# EAGLE design AeroQuadWii_v100 (EAGLE 5.10)
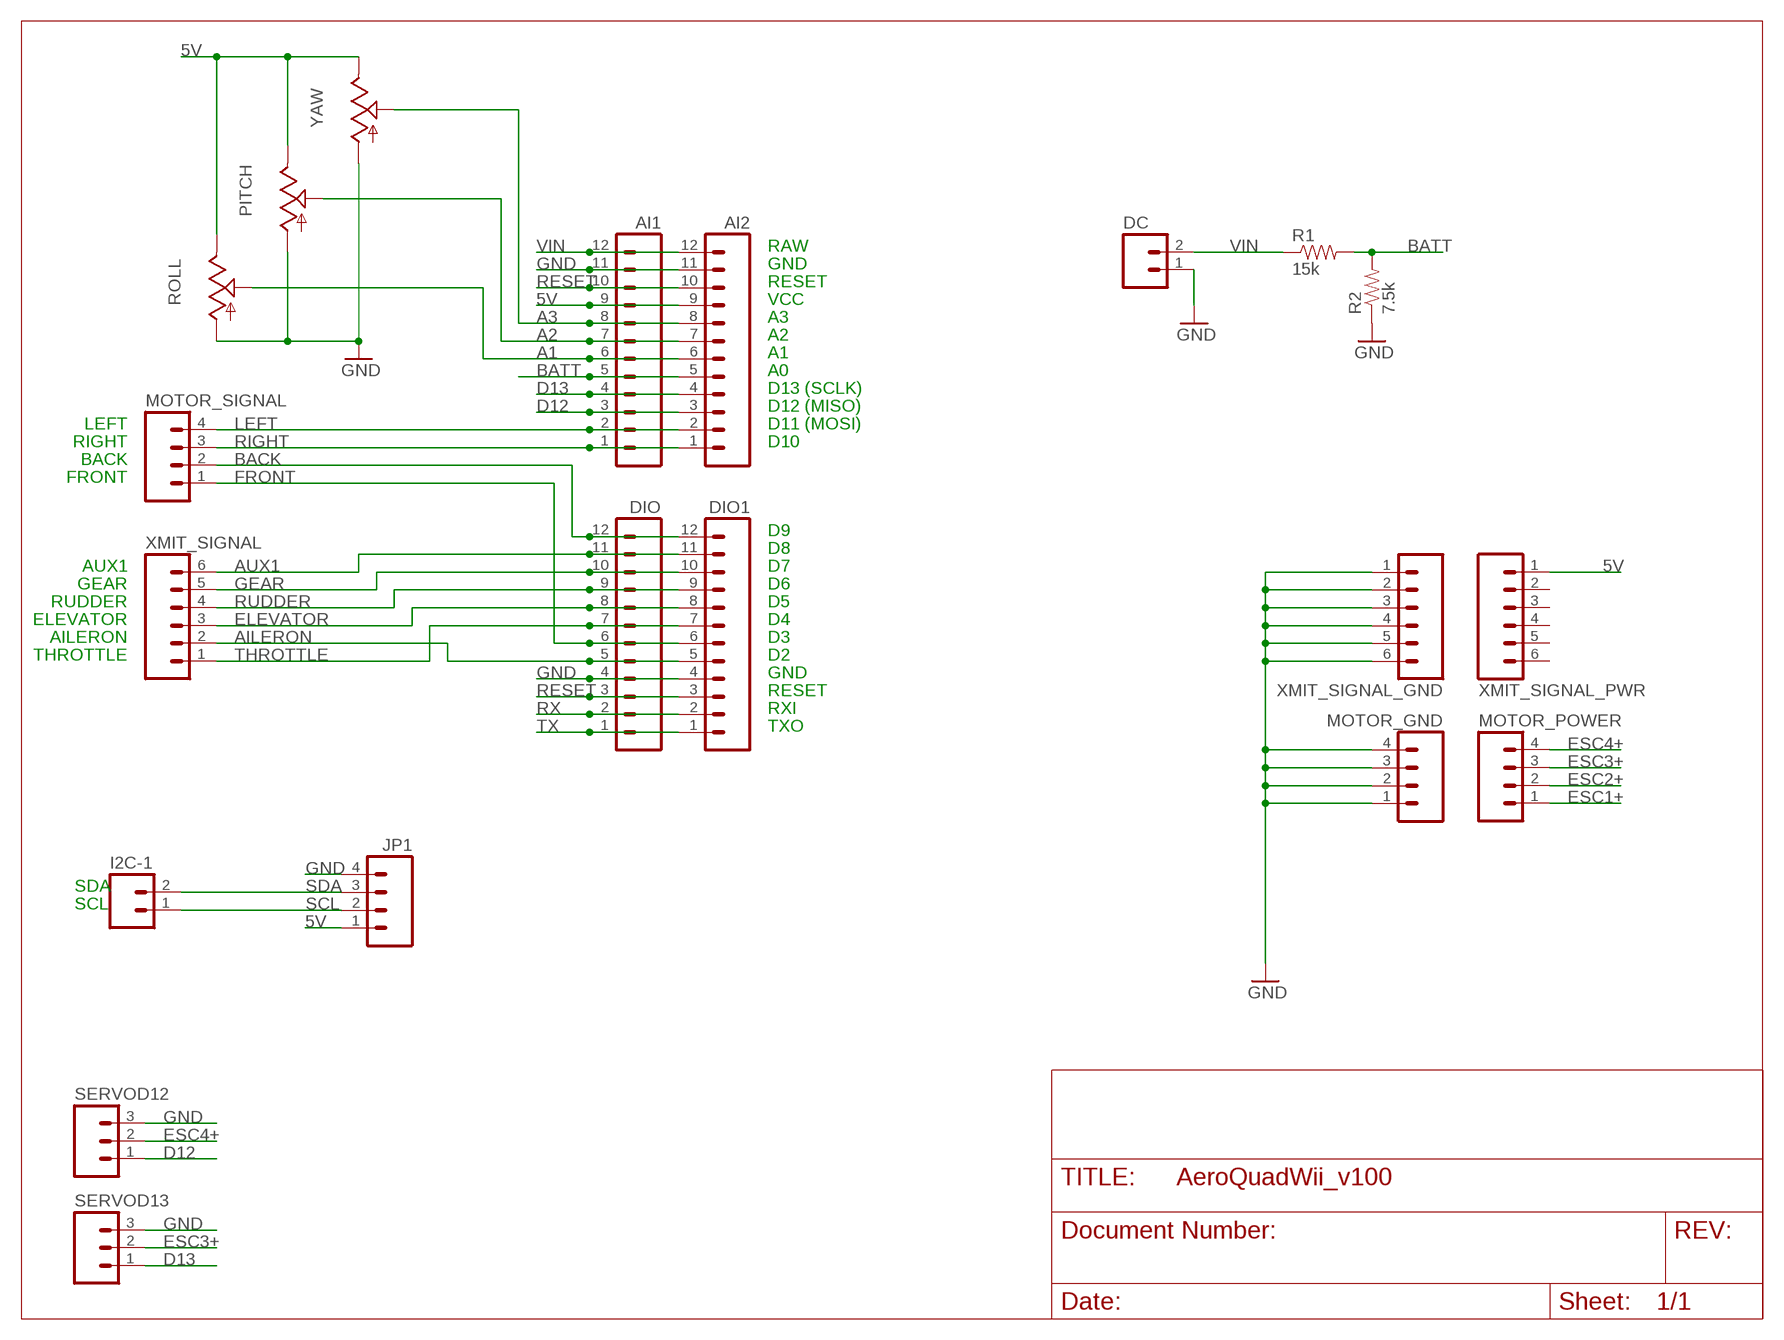
[diagram p0: schematic, sheet 1]

## Parts
AI1  M12LOCK  [1X12_LOCK]
AI2  M12LOCK  [1X12_LOCK]
DC  M02LOCK  [1X02_LOCK]
DIO  M12LOCK  [1X12_LOCK]
DIO1  M12LOCK  [1X12_LOCK]
I2C-1  M02LOCK  [1X02_LOCK]
JP1  M04LOCK  [1X04_LOCK]
MOTOR_GND  M04LOCK  [1X04_LOCK]
MOTOR_POWER  M04LOCK  [1X04_LOCK]
MOTOR_SIGNAL  M04LOCK  [1X04_LOCK]
PITCH  TRIM_US-CA6H  [CA6H]
R1  15k  RESISTORPTH-1/6W  [1/6W-RES]
R2  7.5k  RESISTORPTH-1/6W  [1/6W-RES]
ROLL  TRIM_US-CA6H  [CA6H]
SERVOD12  M03LOCK  [1X03_LOCK]
SERVOD13  M03LOCK  [1X03_LOCK]
XMIT_SIGNAL  M06LOCK  [1X06_LOCK]
XMIT_SIGNAL_GND  M06LOCK  [1X06_LOCK]
XMIT_SIGNAL_PWR  M06LOCK  [1X06_LOCK]
YAW  TRIM_US-CA6H  [CA6H]

## Nets
5V: AI1.9 AI2.9 JP1.1 PITCH.E ROLL.E XMIT_SIGNAL_PWR.1 YAW.E
A1: AI1.6 AI2.6 ROLL.S
A2: AI1.7 AI2.7 PITCH.S
A3: AI1.8 AI2.8 YAW.S
AILERON: DIO1.5 DIO.5 XMIT_SIGNAL.2
AUX1: DIO1.11 DIO.11 XMIT_SIGNAL.6
BACK: DIO1.12 DIO.12 MOTOR_SIGNAL.2
BATT: AI1.5 AI2.5 R1.2 R2.2
D12: AI1.3 AI2.3 SERVOD12.1
D13: AI1.4 AI2.4 SERVOD13.1
ELEVATOR: DIO1.8 DIO.8 XMIT_SIGNAL.3
ESC1+: MOTOR_POWER.1
ESC2+: MOTOR_POWER.2
ESC3+: MOTOR_POWER.3 SERVOD13.2
ESC4+: MOTOR_POWER.4 SERVOD12.2
FRONT: DIO1.6 DIO.6 MOTOR_SIGNAL.1
GEAR: DIO1.10 DIO.10 XMIT_SIGNAL.5
GND: AI1.11 AI2.11 DC.1 DIO1.4 DIO.4 JP1.4 MOTOR_GND.1 MOTOR_GND.2 MOTOR_GND.3 MOTOR_GND.4 PITCH.A R2.1 ROLL.A SERVOD12.3 SERVOD13.3 XMIT_SIGNAL_GND.1 XMIT_SIGNAL_GND.2 XMIT_SIGNAL_GND.3 XMIT_SIGNAL_GND.4 XMIT_SIGNAL_GND.5 XMIT_SIGNAL_GND.6 YAW.A
LEFT: AI1.2 AI2.2 MOTOR_SIGNAL.4
RESET: AI1.10 AI2.10 DIO1.3 DIO.3
RIGHT: AI1.1 AI2.1 MOTOR_SIGNAL.3
RUDDER: DIO1.9 DIO.9 XMIT_SIGNAL.4
RX: DIO1.2 DIO.2
SCL: I2C-1.1 JP1.2
SDA: I2C-1.2 JP1.3
THROTTLE: DIO1.7 DIO.7 XMIT_SIGNAL.1
TX: DIO1.1 DIO.1
VIN: AI1.12 AI2.12 DC.2 R1.1
Unconnected: XMIT_SIGNAL_PWR.2 XMIT_SIGNAL_PWR.3 XMIT_SIGNAL_PWR.4 XMIT_SIGNAL_PWR.5 XMIT_SIGNAL_PWR.6

## Notes on the sheet
- RAW
- GND
- RESET
- VCC
- A3
- A2
- A1
- A0
- D13 (SCLK)
- D12 (MISO)
- LEFT | D11 (MOSI)
- RIGHT | D10
- BACK
- FRONT
- D9
- D8
- AUX1 | D7
- GEAR | D6
- RUDDER | D5
- ELEVATOR | D4
- AILERON | D3
- THROTTLE | D2
- GND
- RESET
- RXI
- TXO
- SDA
- SCL

## Library data of the parts
AI1 AI2 DIO DIO1 = SparkFun:M12: Header 12 Standard 12-pin 0.1" header. Use with straight break away headers (SKU : PRT-00116), right angle break away headers (PRT-00553), swiss pins (PRT-00743), machine pins (PRT-00117), and female headers (PRT-00115).
DC I2C-1 = SparkFun:M02: Header 2 Standard 2-pin 0.1" header. Use with straight break away headers (SKU : PRT-00116), right angle break away headers (PRT-00553), swiss pins (PRT-00743), machine pins (PRT-00117), and female headers (PRT-00115). Molex polarized connector foot print use with SKU : PRT-08233 with associated crimp pins and housings.
JP1 MOTOR_GND MOTOR_POWER MOTOR_SIGNAL = SparkFun:M04: Header 4 Standard 4-pin 0.1" header. Use with straight break away headers (SKU : PRT-00116), right angle break away headers (PRT-00553), swiss pins (PRT-00743), machine pins (PRT-00117), and female headers (PRT-00115). Molex polarized connector foot print use with SKU : PRT-08231 with associated crimp pins and housings.
PITCH ROLL YAW = pot:TRIM_US-: POTENTIOMETER
R1 R2 = SparkFun:RESISTOR: Resistor Basic schematic elements and footprints for 0603, 1206, and PTH 1/10th watt (small) resistors.
SERVOD12 SERVOD13 = SparkFun:M03: Header 3 Standard 3-pin 0.1" header. Use with straight break away headers (SKU : PRT-00116), right angle break away headers (PRT-00553), swiss pins (PRT-00743), machine pins (PRT-00117), and female headers (PRT-00115). Molex polarized connector foot print use with SKU : PRT-08232 with associated crimp pins and housings.
XMIT_SIGNAL XMIT_SIGNAL_GND XMIT_SIGNAL_PWR = SparkFun:M06: Header 6 Standard 6-pin 0.1" header. Use with straight break away headers (SKU : PRT-00116), right angle break away headers (PRT-00553), swiss pins (PRT-00743), machine pins (PRT-00117), and female headers (PRT-00115). Molex polarized connector foot print use with SKU : PRT-08094 with associated crimp pins and housings. NOTES ON THE VARIANTS LOCK and LOCK_LONGPADS... This footprint was designed to help hold the alignment of a through-hole component (i.e. 6-pin header) while soldering it into place. You may notice that each hole has been shifted either up or down by 0.005 of an inch from it's more standard position (which is a perfectly straight line). This slight alteration caused the pins (the squares in the middle) to touch the edges of the holes. Because they are alternating, it causes a "brace" to hold the component in place. 0.005 has proven to be the perfect amount of "off-center" position when using our standard breakaway headers. Although looks a little odd when you look at the bare footprint, once you have a header in there, the alteration is very hard to notice. Also, if you push a header all the way into place, it is covered up entirely on the bottom side. This idea of altering the position of holes to aid alignment will be further integrated into the Sparkfun Library for other footprints. It can help hold any component with 3 or more connection pins.

## Board
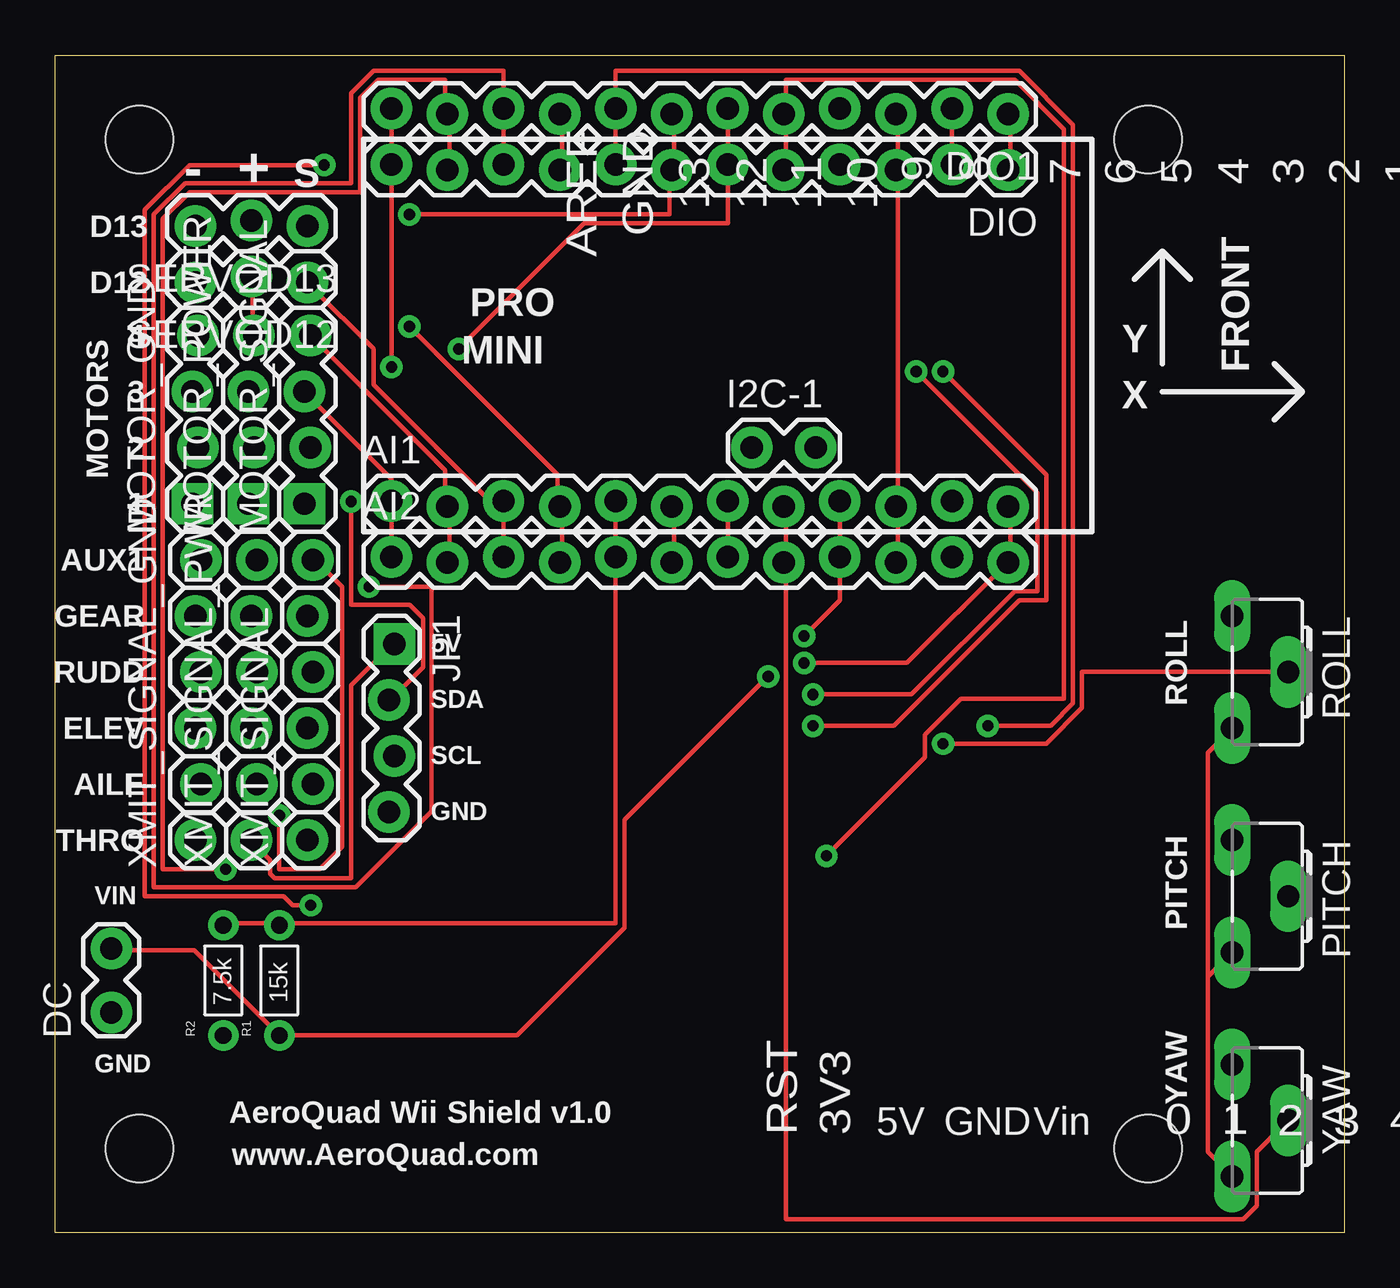
[diagram p1: board, top side]
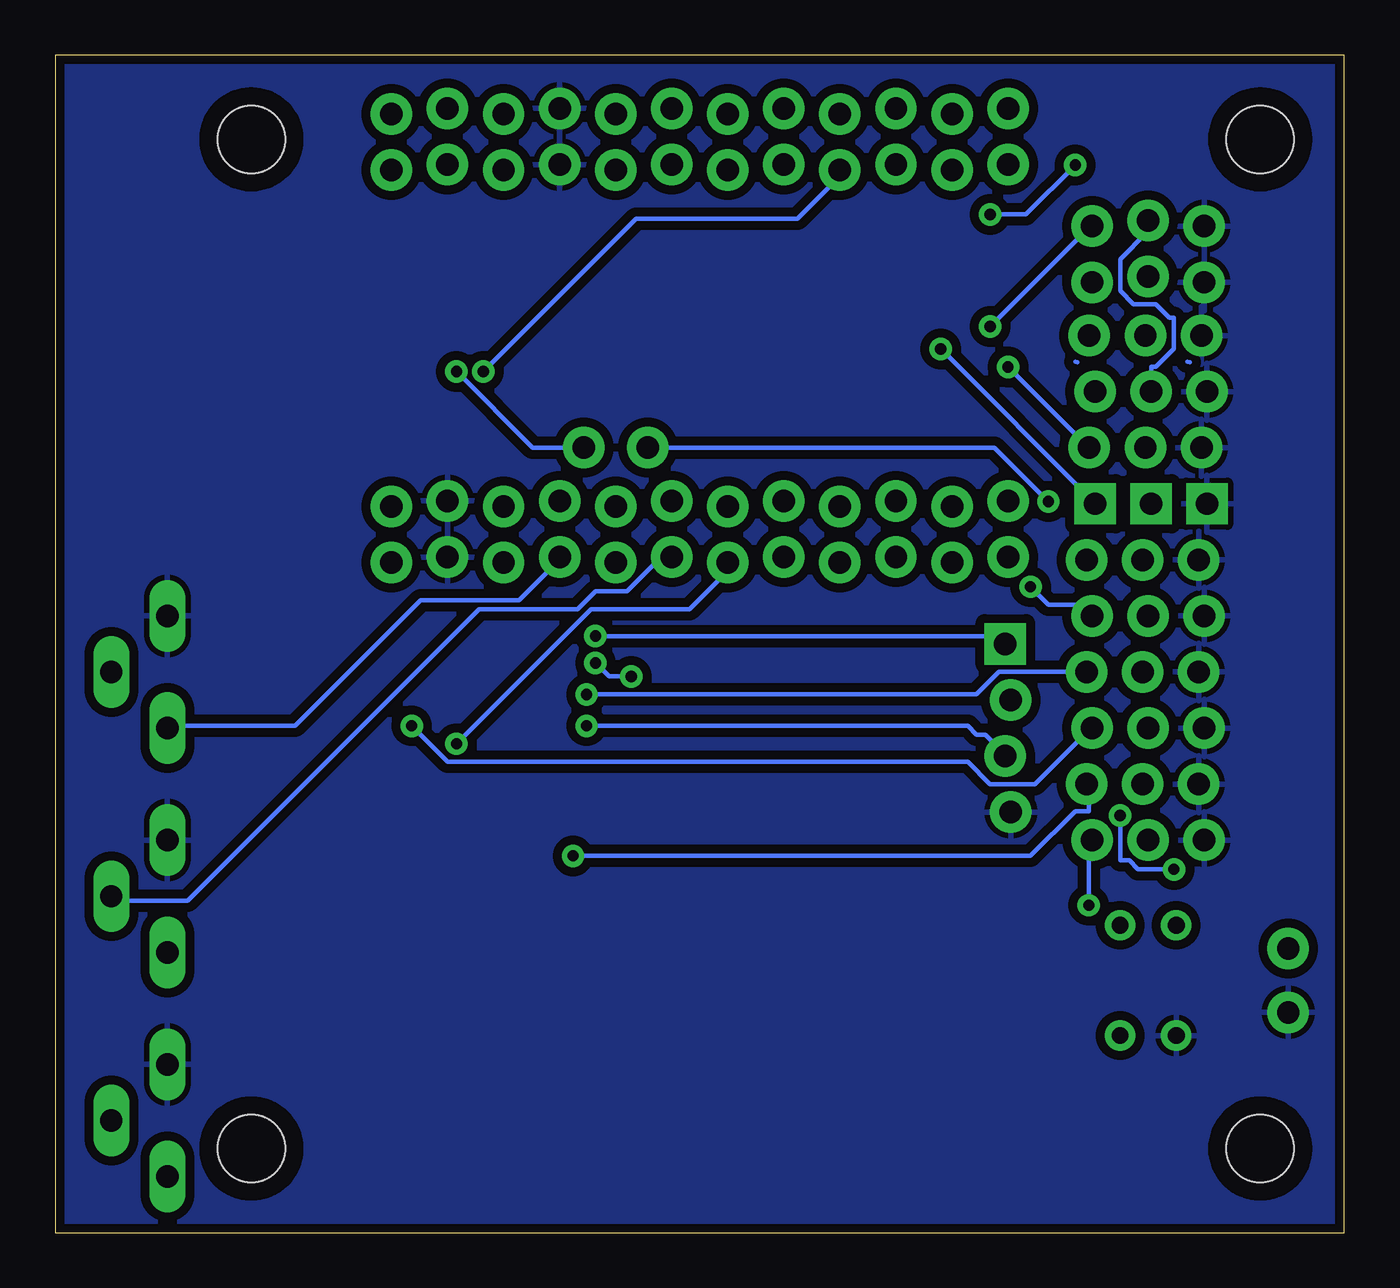
[diagram p2: board, bottom side, seen from below]

Size 58.42 x 53.34 mm. Coordinates in mm from the lower left corner, seen from the top.
Outline: 0,53.34 58.42,53.34 58.42,0 0,0 0,53.34
Copper layers (1*16): Top 0.035mm / dielectric 1.5mm / Bottom 0.035mm
Design rules "SparkFun": minimum track width 8mil, minimum drill 20mil, track to track 8mil, track to pad 8mil, pad to pad 8mil, via to via 8mil, smd to smd 8mil, copper to edge 10mil, drill to drill 8mil, minimum pad ring 12mil, minimum via ring 10mil, stop-mask expansion 4mil, vias tented up to drill 25mil, thermal gap 10mil

### Footprints (pad centres in the part's own frame; a part is rotated, then mirrored left to right if it is on the bottom)
1X12_LOCK = drill 1.016 pad 1.88 round: 1 0,0.127; 2 2.54,-0.127; 3 5.08,0.127; 4 7.62,-0.127; 5 10.16,0.127; 6 12.7,-0.127; 7 15.24,0.127; 8 17.78,-0.127; 9 20.32,0.127; 10 22.86,-0.127; 11 25.4,0.127; 12 27.94,-0.127
1X02_LOCK = drill 1.016 pad 1.88 round: 1 -0.178,0; 2 2.718,0
1X04_LOCK = drill 1.016 pad 1.88 square: 1 0,0.127 | drill 1.016 pad 1.88 round: 2 2.54,-0.127; 3 5.08,0.127; 4 7.62,-0.127
CA6H = drill 1.016 long: A -2.54,0; E 2.54,0; S 0,2.54
1/6W-RES = drill 0.762 round: 1 -2.5,0; 2 2.5,0
1X03_LOCK = drill 1.016 pad 1.88 round: 1 0,0.127; 2 2.54,-0.127; 3 5.08,0.127
STAND-OFF-TIGHT = hole 3.048: 0,0
1X06_LOCK = drill 1.016 pad 1.88 round: 1 0,0; 2 2.54,-0.254; 3 5.08,0; 4 7.62,-0.254; 5 10.16,0; 6 12.7,-0.254

### Placement (x,y rotation side)
AI1  15.24,33.02 0 top
AI2  15.24,30.48 0 top
DC  2.54,10.16 90 top
DIO  43.18,48.26 180 top
DIO1  43.18,50.8 180 top
I2C-1  31.75,35.56 0 top
JP1  15.24,26.67 270 top
MOTOR_GND  6.35,33.02 90 top
MOTOR_POWER  8.89,33.02 90 top
MOTOR_SIGNAL  11.43,33.02 90 top
PITCH  53.34,15.24 270 top
R1  10.16,11.43 90 top
R2  7.62,11.43 90 top
ROLL  53.34,25.4 270 top
SERVOD12  11.43,43.18 180 top
SERVOD13  11.43,45.72 180 top
U$1  [STAND-OFF-TIGHT]  3.81,3.81 0 top
U$3  [STAND-OFF-TIGHT]  49.53,49.53 0 top
U$4  [STAND-OFF-TIGHT]  49.53,3.81 0 bottom
U$5  [STAND-OFF-TIGHT]  3.81,49.53 0 top
XMIT_SIGNAL  11.43,17.78 90 top
XMIT_SIGNAL_GND  6.35,17.78 90 top
XMIT_SIGNAL_PWR  8.89,17.78 90 top
YAW  53.34,5.08 270 top

### Tracks (layer width: path | path; a pad name or v marks a point on that pad's centre or on a via)
5V  (via drill 0.51)
  Top 0.203: XMIT_SIGNAL_PWR.1 8.94,17.68 9.75,16.87 9.75,16.26 9.96,16.05 13.41,16.05 13.41,24.79 15.24,26.62 JP1.1 | AI1.9 AI2.9 35.56,28.65 v33.93,27.03 | 52.22,11.58 52.22,3.66 YAW.E | 52.22,11.58 PITCH.E | 52.22,11.58 52.22,21.74 ROLL.E
  Bottom 0.203: AI2.9 35.56,30.48 37.39,28.65 41.86,28.65 47.55,22.96 53.24,22.96 ROLL.E | v33.93,27.03 15.65,27.03 15.44,26.82 JP1.1
A1  (via drill 0.51)
  Top 0.203: ROLL.S 46.53,25.4 46.53,23.77 44.91,22.15 v40.23,22.15 | AI1.6 28.04,32.72 28.04,30.48 AI2.6
  Bottom 0.203: v40.23,22.15 34.14,28.25 29.67,28.25 28.04,29.87 28.04,30.28 AI2.6
A2
  Top 0.203: AI2.7 AI1.7
  Bottom 0.203: PITCH.S 55.68,15.04 52.43,15.04 39.22,28.25 34.75,28.25 33.93,29.06 32.51,29.06 31.09,30.48 30.48,30.48 AI2.7
A3
  Top 0.203: YAW.S 54.46,3.66 54.46,1.22 53.85,0.61 33.12,0.61 33.12,30.28 AI2.8 33.12,30.48 33.12,32.72 AI1.8
AILERON  (via drill 0.51)
  Top 0.203: v34.95,17.07 39.42,21.54 39.42,22.55 41.05,24.18 45.72,24.18 45.72,49.99 43.48,52.22 33.12,52.22 33.12,50.8 DIO1.5 33.12,50.6 33.12,48.16 DIO.5
  Bottom 0.203: v34.95,17.07 14.22,17.07 12.19,19.1 11.58,19.1 11.58,20.32 XMIT_SIGNAL.2
AUX1  (via drill 0.51)
  Top 0.203: v10.16,18.9 10.16,16.46 11.99,16.46 13.01,17.48 13.01,29.26 11.79,30.48 XMIT_SIGNAL.6 | v7.72,16.46 4.88,16.46 4.88,45.92 6.1,47.14 13.82,47.14 13.82,51.41 14.63,52.22 17.68,52.22 17.68,50.8 DIO1.11 17.88,50.6 17.88,48.16 DIO.11
  Bottom 0.203: v10.16,18.9 10.16,16.87 9.75,16.87 9.35,16.46 v7.72,16.46
BACK  (via drill 0.51)
  Top 0.203: v15.24,39.22 DIO.12 DIO1.12
  Bottom 0.203: v15.24,39.22 11.58,35.56 MOTOR_SIGNAL.2
BATT
  Top 0.203: 10.16,14.02 7.72,14.02 R2.2 | 10.16,14.02 25.4,14.02 AI2.5 AI1.5 | 10.16,14.02 R1.2
D12
  Top 0.203: 20.32,32.51 AI2.3 | 20.32,32.51 14.43,38.41 14.43,40.03 11.58,42.88 SERVOD12.1 | 20.32,32.51 AI1.3
D13  (via drill 0.51)
  Top 0.203: AI2.4 22.96,30.48 22.96,32.72 AI1.4 22.76,32.92 22.76,34.34 v16.05,41.05
  Bottom 0.203: v16.05,41.05 11.58,45.52 SERVOD13.1
ELEVATOR  (via drill 0.51)
  Top 0.203: v42.27,22.96 45.11,22.96 46.13,23.98 46.13,50.19 43.69,52.63 25.4,52.63 DIO1.8 DIO.8
  Bottom 0.203: v42.27,22.96 40.64,21.34 17.07,21.34 16.05,20.32 14.02,20.32 11.58,22.76 XMIT_SIGNAL.3
ESC3+
  Bottom 0.203: MOTOR_POWER.3 8.74,38.2 8.74,39.22 8.53,39.22 7.72,40.03 7.72,41.45 7.92,41.45 8.53,42.06 9.55,42.06 10.16,42.67 10.16,44.09 8.94,45.31 8.94,45.72 SERVOD13.2
ESC4+
  Top 0.203: SERVOD12.2 8.94,43.28 8.94,40.64 MOTOR_POWER.4
FRONT  (via drill 0.51)
  Top 0.203: v18.29,40.03 23.98,45.72 30.48,45.72 DIO.6 DIO1.6
  Bottom 0.203: v18.29,40.03 11.38,33.12 MOTOR_SIGNAL.1
GEAR  (via drill 0.51)
  Top 0.203: v14.22,29.26 17.07,29.26 17.07,19.1 13.61,15.65 4.47,15.65 4.47,46.13 5.89,47.55 13.41,47.55 13.41,51.61 14.43,52.63 20.32,52.63 DIO1.10 DIO.10
  Bottom 0.203: v14.22,29.26 13.41,28.45 11.99,28.45 11.58,28.04 XMIT_SIGNAL.5
GND
  pour Bottom (isolate 0.406): 0,53.34 58.42,53.34 58.42,0 0,0
LEFT
  Top 0.203: AI2.2 17.88,30.48 17.88,32.72 AI1.2 17.68,32.92 17.68,34.54 11.58,40.64 MOTOR_SIGNAL.4
N$7
  Bottom 0.203: 12.09,39.42 12.19,39.45
N$10
  Bottom 0.203: 7.01,39.42 7.11,39.45
RESET
  Top 0.203: AI2.10 38.2,30.48 38.2,32.72 AI1.10 38.2,32.92 38.2,47.95 DIO.3 38.2,48.16 38.2,50.6 DIO1.3
RIGHT
  Top 0.203: AI2.1 AI1.1 15.24,34.14 11.38,38 MOTOR_SIGNAL.3
RUDDER  (via drill 0.51)
  Top 0.203: v34.34,24.38 38.81,24.38 43.48,29.06 44.5,29.06 44.5,33.53 v39.01,39.01 | DIO1.9 22.96,50.6 22.96,48.16 DIO.9
  Bottom 0.203: v34.34,24.38 16.66,24.38 15.65,25.4 XMIT_SIGNAL.4 | v39.01,39.01 32.11,45.92 24.79,45.92 22.76,47.95 DIO.9
RX
  Top 0.203: DIO.2 DIO1.2
SCL  (via drill 0.51)
  Top 0.203: v13.41,33.12 13.41,28.45 16.05,28.45 16.66,27.84 16.66,25.6 15.24,24.18 JP1.2
  Bottom 0.203: v13.41,33.12 15.85,35.56 I2C-1.1
SDA  (via drill 0.51)
  Top 0.203: v34.34,22.96 38,22.96 43.69,28.65 44.91,28.65 44.91,34.34 v40.23,39.01
  Bottom 0.203: v34.34,22.96 17.07,22.96 16.66,22.55 16.26,22.55 15.44,21.74 JP1.3 | v40.23,39.01 36.78,35.56 I2C-1.2
THROTTLE  (via drill 0.51)
  Top 0.203: v11.58,14.83 10.77,14.83 10.36,15.24 4.06,15.24 4.06,46.33 6.1,48.36 v12.19,48.36 | v16.05,46.13 27.84,46.13 27.84,47.95 DIO.7 28.04,48.16 28.04,50.6 DIO1.7
  Bottom 0.203: v11.58,14.83 11.58,17.68 XMIT_SIGNAL.1 | v12.19,48.36 14.43,46.13 v16.05,46.13
TX
  Top 0.203: DIO.1 43.28,48.16 43.28,50.6 DIO1.1
VIN  (via drill 0.51)
  Top 0.203: AI1.12 43.28,32.72 43.28,30.48 AI2.12 43.08,30.28 38.61,25.81 v33.93,25.81 | 10.16,8.94 6.3,12.8 2.64,12.8 DC.2 | v32.31,25.2 25.81,18.69 25.81,13.82 20.93,8.94 10.16,8.94 | 10.16,8.94 R1.1
  Bottom 0.203: v33.93,25.81 33.33,25.2 v32.31,25.2

### Text on the board
tPlace: - | + | S | D13 | D12 | PRO | 4 | Y | 3 | MINI | X | FRONT | 2 | MOTORS | 1 | AUX1 | GEAR | RUDD | 5V | SDA | ROLL | ELEV | AILE | SCL | GND | THRO | VIN | PITCH | YAW | GND | AeroQuad Wii Shield v1.0 | www.AeroQuad.com
tNames: 9 | 8 | 7 | 6 | 5 | 4 | 3 | 2 | 1 | 0 | 13 | 12 | 11 | 10 | GND | AREF | RST | 3V3 | 5V | GND | Vin | 0 | 1 | 2 | 3 | 4 | 5